# EAGLE design m8-led-blink-smd (EAGLE 5.11)
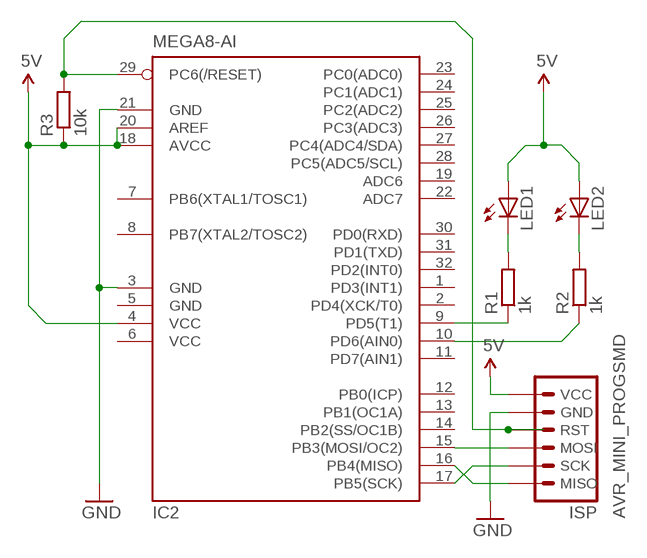
[diagram p0: schematic, sheet 1]

## Parts
IC2  MEGA8-AI  [TQFP32-08]
ISP  AVR_MINI_PROGSMD  [AVR_MINI_PROG]
LED1  LED1206  [LED-1206]
LED2  LED1206  [LED-1206]
R1  1k  R-EU_R1206  [R1206]
R2  1k  R-EU_R1206  [R1206]
R3  10k  R-EU_M1206  [M1206]

## Nets
5V: IC2.4(VCC) IC2.18(AVCC) IC2.20(AREF) ISP.1(VCC) LED1.A LED2.A R3.1
GND: IC2.3(GND) IC2.21(GND) ISP.2(GND)
N$1: IC2.9(PD5(T1)) R1.1
N$2: IC2.10(PD6(AIN0)) R2.1
N$3: LED2.C R2.2
N$4: LED1.C R1.2
N$5: IC2.17(PB5(SCK)) ISP.5(SCK)
N$6: IC2.16(PB4(MISO)) ISP.6(MISO)
N$7: IC2.15(PB3(MOSI/OC2)) ISP.4(MOSI)
N$9: IC2.29(PC6(/RESET)) ISP.3(RST) R3.2
Unconnected: IC2.1(PD3(INT1)) IC2.2(PD4(XCK/T0)) IC2.7(PB6(XTAL1/TOSC1)) IC2.8(PB7(XTAL2/TOSC2)) IC2.11(PD7(AIN1)) IC2.12(PB0(ICP)) IC2.13(PB1(OC1A)) IC2.14(PB2(SS/OC1B)) IC2.19(ADC6) IC2.22(ADC7) IC2.23(PC0(ADC0)) IC2.24(PC1(ADC1)) IC2.25(PC2(ADC2)) IC2.26(PC3(ADC3)) IC2.27(PC4(ADC4/SDA)) IC2.28(PC5(ADC5/SCL)) IC2.30(PD0(RXD)) IC2.31(PD1(TXD)) IC2.32(PD2(INT0))

## Power pins joined to a net without a drawn wire
GND: IC2.5(GND)
VCC: IC2.6(VCC)

## Library data of the parts
IC2 = atmel:MEGA8: MICROCONTROLLER 8 Kbytes FLASH, 1 kbytes SRAM, 512 bytes EEPROM, USART, 6-channel 10 bit ADC, 2-channel 8 bit ADC Pin compatible with Atmega48, ATMega88, ATMega168 Source: avr.lbr; MPN: ATMEGA8-16AU; OC_FARNELL: 9171371; OC_NEWARK: 73M8863
ISP = SparkFun:AVR_MINI_PROG
LED1 LED2 = SparkFun:LED: LEDs Standard schematic elements and footprints for 5mm, 3mm, 1206, and 0603 sized LEDs. 5mm - Spark Fun Electronics SKU : COM-00529 (and others)
R1-R3 = rcl:R-EU_: RESISTOR, European symbol

## Net classes
0 default: width 0.61 mm

## Board
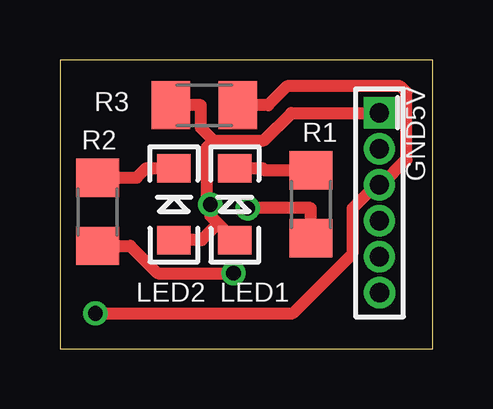
[diagram p1: board, top side]
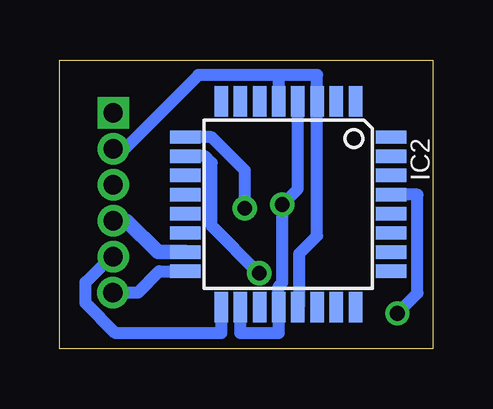
[diagram p2: board, bottom side, seen from below]

Size 15.55 x 12.05 mm. Coordinates in mm from the lower left corner, seen from the top.
Outline: 15.55,0 15.55,12.05 0,12.05 0,0 15.55,0
Copper layers (1*16): Top 0.035mm / dielectric 1.5mm / Bottom 0.035mm
Design rules "default": minimum track width 10mil, minimum drill 24mil, track to track 8mil, track to pad 8mil, pad to pad 8mil, via to via 8mil, smd to smd 8mil, copper to edge 40mil, drill to drill 8mil, minimum pad ring 10mil, minimum via ring 8mil, stop-mask expansion 4mil, vias tented up to drill 0mil, thermal gap 10mil

### Footprints (pad centres in the part's own frame; a part is rotated, then mirrored left to right if it is on the bottom)
TQFP32-08 = smd 1.27 x 0.559: 1 -4.293,2.8; 2 -4.293,2; 3 -4.293,1.2; 4 -4.293,0.4; 5 -4.293,-0.4; 6 -4.293,-1.2; 7 -4.293,-2; 8 -4.293,-2.8; 17 4.293,-2.8; 18 4.293,-2; 19 4.293,-1.2; 20 4.293,-0.4; 21 4.293,0.4; 22 4.293,1.2; 23 4.293,2; 24 4.293,2.8 | smd 0.559 x 1.27: 9 -2.8,-4.293; 10 -2,-4.293; 11 -1.2,-4.293; 12 -0.4,-4.293; 13 0.4,-4.293; 14 1.2,-4.293; 15 2,-4.293; 16 2.8,-4.293; 25 2.8,4.293; 26 2,4.293; 27 1.2,4.293; 28 0.4,4.293; 29 -0.4,4.293; 30 -1.2,4.293; 31 -2,4.293; 32 -2.8,4.293
AVR_MINI_PROG = drill 0.8 pad 1.27 square: 1 0,0 | drill 0.8 pad 1.27 round: 2 1.5,0; 3 3,0; 4 4.5,0; 5 6,0; 6 7.5,0.01
LED-1206 = smd 1.2 x 1.4: A -1.5,0; C 1.5,0
R1206 = smd 1.6 x 1.803: 1 -1.422,0; 2 1.422,0
M1206 = smd 1.6 x 2: 1 -1.4,0; 2 1.4,0

### Placement (x,y rotation side)
IC2  6.02,6.03 270 bottom
ISP  13.33,9.84 270 top
LED1  7.29,6.03 90 top
LED2  4.75,6.03 90 top
R1  10.47,6.03 90 top
R2  1.58,5.71 90 top
R3  6.02,10.16 0 top

### Tracks (layer width: path | path; a pad name or v marks a point on that pad's centre or on a via)
5V  (via drill 0.61 pad 1.02)
  Top 0.508: 6.6,5.22 LED1.A | 6.6,5.22 6.27,5.55 v6.27,6.02 6.13,6.16 6.13,8.42 6.41,8.69 | 6.6,5.22 5.91,4.53 LED2.A | 6.41,8.69 8.49,8.69 9.65,9.84 ISP.1 | 6.41,8.69 5.88,9.22 5.88,10.16 R3.1
  Bottom 0.508: IC2.4 5.62,6.67 v6.27,6.02 6.27,2.75 6.42,2.6 IC2.20 6.42,0.65 8.02,0.65 IC2.18
GND
  Bottom 0.508: 6.42,11.42 4.82,11.42 IC2.3 4.82,4.71 5.56,3.97 5.56,1.8 IC2.21 | 6.42,11.42 IC2.5 | ISP.2 12.85,8.34 9.78,11.42 6.42,11.42
N$1  (via drill 0.61 pad 1.02)
  Top 0.508: v7.84,5.87 10.47,5.87 R1.1
  Bottom 0.508: IC2.9 9.22,8.83 7.84,7.45 v7.84,5.87
N$2  (via drill 0.61 pad 1.02)
  Top 0.508: R2.1 2.94,4.29 4.08,3.15 v7.24,3.15
  Bottom 0.508: v7.24,3.15 9.22,5.14 9.22,7.76 9.5,8.03 IC2.10
N$3
  Top 0.508: LED2.C 3.6,7.53 3.2,7.14 R2.2
N$4
  Top 0.508: LED1.C 8.45,7.53 8.53,7.46 R1.2
N$5
  Bottom 0.508: IC2.17 8.82,0.65 13.22,0.65 14.48,1.91 14.48,2.78 13.42,3.84 ISP.5
N$6
  Bottom 0.508: IC2.16 11.41,3.23 12.3,2.34 ISP.6
N$7
  Bottom 0.61: IC2.15 11.46,4.03 12.77,5.34 ISP.4
N$9  (via drill 0.61 pad 1.02)
  Top 0.508: v1.48,1.48 9.71,1.48 12.21,3.98 12.21,5.87 13.19,6.84 ISP.3 13.41,6.84 14.45,7.89 14.45,10.7 14.2,10.95 9.47,10.95 8.68,10.16 R3.2
  Bottom 0.508: IC2.29 0.64,6.43 0.64,2.32 v1.48,1.48

### Text on the board
tNames: 5V | GND